# EAGLE design Felderblock mini (EAGLE 7.6.0)
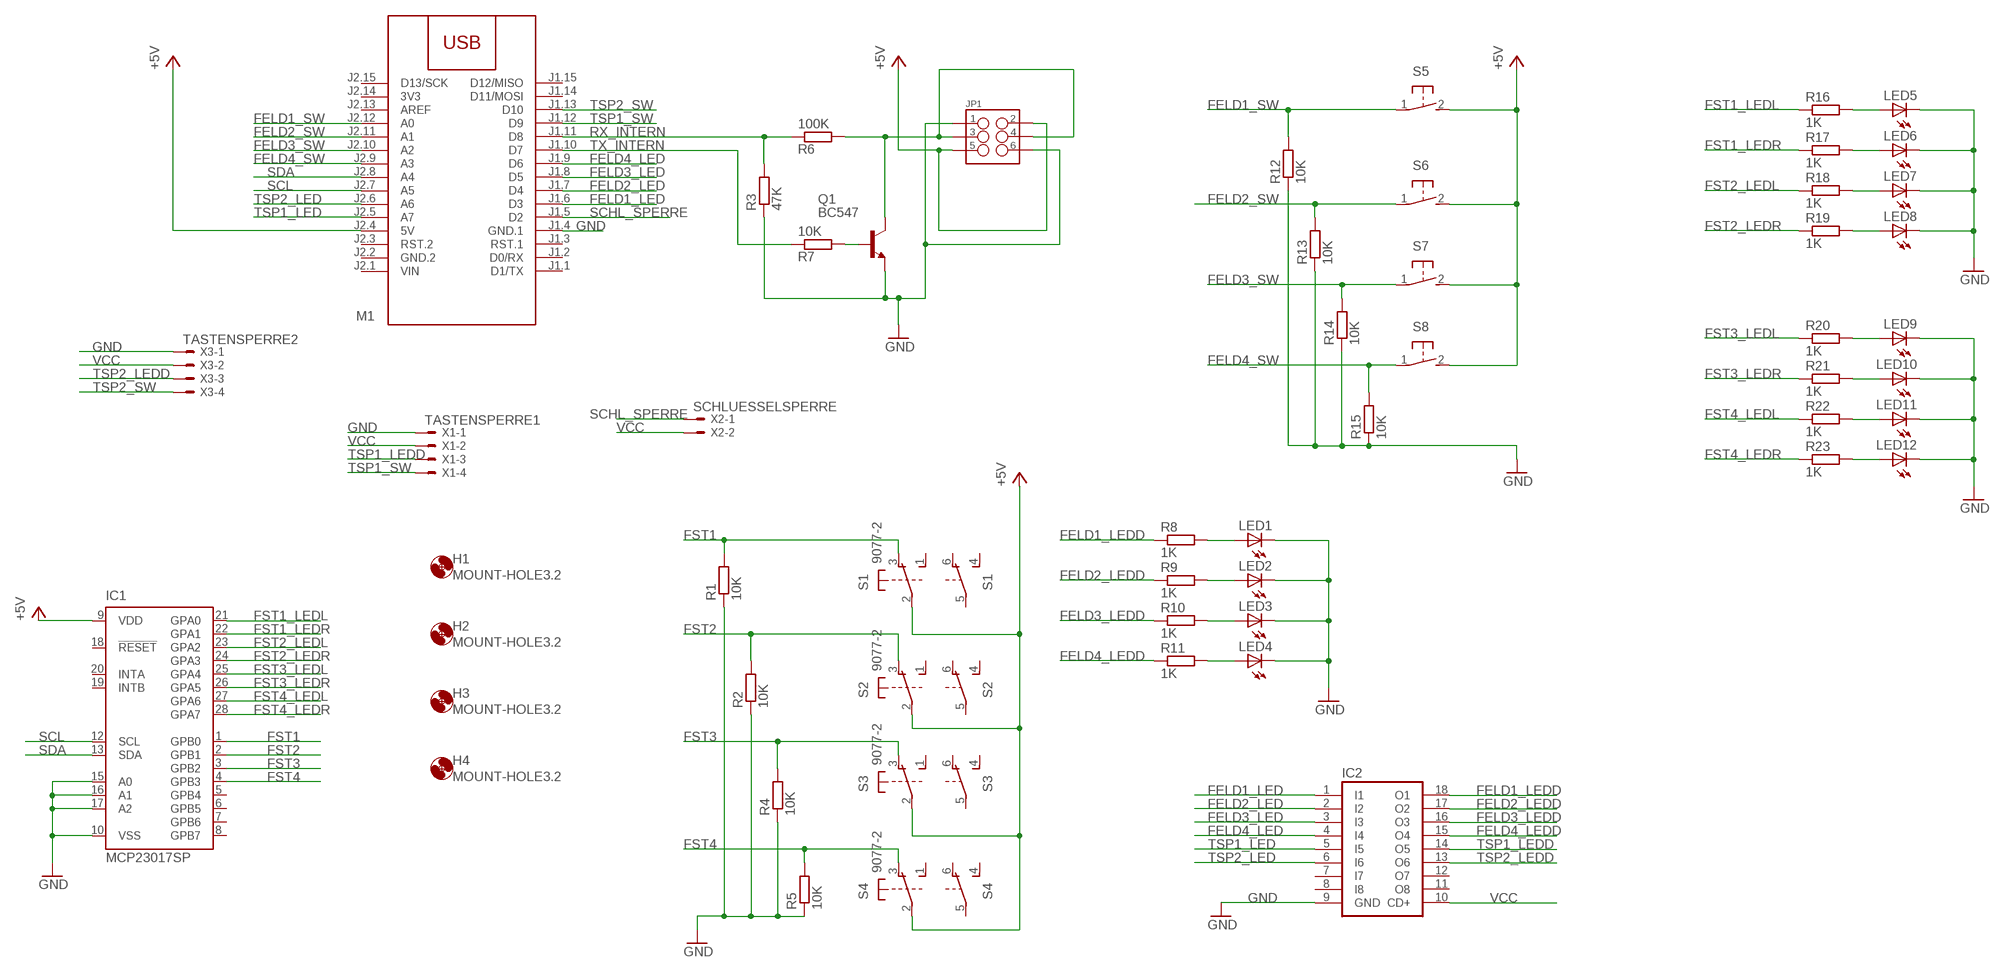
[diagram p0: schematic, sheet 1]

## Parts
H1  MOUNT-HOLE3.2  [3,2]
H2  MOUNT-HOLE3.2  [3,2]
H3  MOUNT-HOLE3.2  [3,2]
H4  MOUNT-HOLE3.2  [3,2]
IC1  MCP23017SP  [DIL28-3]
IC2  ULN2803A  [DIL18]
JP1  M03X2SHROUD  [2X3-SHROUDED]
LED1  LED10MM  [LED10MM]
LED2  LED10MM  [LED10MM]
LED3  LED10MM  [LED10MM]
LED4  LED10MM  [LED10MM]
LED5  LED5MM  [LED5MM]
LED6  LED5MM  [LED5MM]
LED7  LED5MM  [LED5MM]
LED8  LED5MM  [LED5MM]
LED9  LED5MM  [LED5MM]
LED10  LED5MM  [LED5MM]
LED11  LED5MM  [LED5MM]
LED12  LED5MM  [LED5MM]
M1  ARDUINO-NANO-3.0  [ARDUINO-NANO-3.0]
Q1  BC547  [TO92]
R1  10K  R-EU_0207/7  [0207/7]
R2  10K  R-EU_0207/7  [0207/7]
R3  47K  R-EU_R1206  [R1206]
R4  10K  R-EU_0207/7  [0207/7]
R5  10K  R-EU_0207/7  [0207/7]
R6  100K  R-EU_R1206  [R1206]
R7  10K  R-EU_R1206  [R1206]
R8  1K  R-EU_0207/7  [0207/7]
R9  1K  R-EU_0207/7  [0207/7]
R10  1K  R-EU_0207/7  [0207/7]
R11  1K  R-EU_0207/7  [0207/7]
R12  10K  R-EU_0207/7  [0207/7]
R13  10K  R-EU_0207/7  [0207/7]
R14  10K  R-EU_0207/7  [0207/7]
R15  10K  R-EU_0207/7  [0207/7]
R16  1K  R-EU_0207/7  [0207/7]
R17  1K  R-EU_0207/7  [0207/7]
R18  1K  R-EU_0207/7  [0207/7]
R19  1K  R-EU_0207/7  [0207/7]
R20  1K  R-EU_0207/7  [0207/7]
R21  1K  R-EU_0207/7  [0207/7]
R22  1K  R-EU_0207/7  [0207/7]
R23  1K  R-EU_0207/7  [0207/7]
S1  9077-2  [9077-2]
S2  9077-2  [9077-2]
S3  9077-2  [9077-2]
S4  9077-2  [9077-2]
S5  31-XX  [B3F-31XX]
S6  31-XX  [B3F-31XX]
S7  31-XX  [B3F-31XX]
S8  31-XX  [B3F-31XX]
X1  TASTENSPERRE1  22-23-2041  [22-23-2041]
X2  SCHLUESSELSPERRE  22-23-2021  [22-23-2021]
X3  TASTENSPERRE2  22-23-2041  [22-23-2041]

## Nets
FELD1_LED: IC2.1(I1) M1.J1.6(D3)
FELD1_LEDD: IC2.18(O1) R8.1
FELD1_SW: M1.J2.12(A0) R12.2 S5.1(P)
FELD2_LED: IC2.2(I2) M1.J1.7(D4)
FELD2_LEDD: IC2.17(O2) R9.1
FELD2_SW: M1.J2.11(A1) R13.2 S6.1(P)
FELD3_LED: IC2.3(I3) M1.J1.8(D5)
FELD3_LEDD: IC2.16(O3) R10.1
FELD3_SW: M1.J2.10(A2) R14.2 S7.1(P)
FELD4_LED: IC2.4(I4) M1.J1.9(D6)
FELD4_LEDD: IC2.15(O4) R11.1
FELD4_SW: M1.J2.9(A3) R15.2 S8.1(P)
FST1: IC1.1(GPB0) R1.2 S1.3(1:O)
FST1_LEDL: IC1.21(GPA0) R16.1
FST1_LEDR: IC1.22(GPA1) R17.1
FST2: IC1.2(GPB1) R2.2 S2.3(1:O)
FST2_LEDL: IC1.23(GPA2) R18.1
FST2_LEDR: IC1.24(GPA3) R19.1
FST3: IC1.3(GPB2) R4.2 S3.3(1:O)
FST3_LEDL: IC1.25(GPA4) R20.1
FST3_LEDR: IC1.26(GPA5) R21.1
FST4: IC1.4(GPB3) R5.2 S4.3(1:O)
FST4_LEDL: IC1.27(GPA6) R22.1
FST4_LEDR: IC1.28(GPA7) R23.1
GND: IC1.10(VSS) IC1.15(A0) IC1.16(A1) IC1.17(A2) IC2.9(GND) JP1.1 JP1.6 LED1.C LED2.C LED3.C LED4.C LED5.K(C) LED6.K(C) LED7.K(C) LED8.K(C) LED9.K(C) LED10.K(C) LED11.K(C) LED12.K(C) M1.J1.4(GND.1) Q1.1(E) R1.1 R2.1 R3.1 R4.1 R5.1 R12.1 R13.1 R14.1 R15.1 X1.1 X3.1
LN: JP1.3 JP1.4 Q1.3(C) R6.2
N$1: LED1.A R8.2
N$2: LED2.A R9.2
N$3: LED3.A R10.2
N$4: LED4.A R11.2
N$5: Q1.2(B) R7.2
N$6: LED5.A R16.2
N$7: LED6.A R17.2
N$8: LED7.A R18.2
N$9: LED8.A R19.2
N$10: LED9.A R20.2
N$11: LED10.A R21.2
N$12: LED11.A R22.2
N$13: LED12.A R23.2
RX_INTERN: M1.J1.11(D8) R3.2 R6.1
SCHL_SPERRE: M1.J1.5(D2) X2.1
SCL: IC1.12(SCL) M1.J2.7(A5)
SDA: IC1.13(SDA) M1.J2.8(A4)
TSP1_LED: IC2.5(I5) M1.J2.5(A7)
TSP1_LEDD: IC2.14(O5) X1.3
TSP1_SW: M1.J1.12(D9) X1.4
TSP2_LED: IC2.6(I6) M1.J2.6(A6)
TSP2_LEDD: IC2.13(O6) X3.3
TSP2_SW: M1.J1.13(D10) X3.4
TX_INTERN: M1.J1.10(D7) R7.1
VCC: IC1.9(VDD) IC2.10(CD+) JP1.2 JP1.5 M1.J2.4(5V) S1.2(1:P) S2.2(1:P) S3.2(1:P) S4.2(1:P) S5.2(S) S6.2(S) S7.2(S) S8.2(S) X1.2 X2.2 X3.2 ; supply symbol labelled +5V
Unconnected: IC1.5(GPB4) IC1.6(GPB5) IC1.7(GPB6) IC1.8(GPB7) IC1.18(!RESET) IC1.19(INTB) IC1.20(INTA) IC2.7(I7) IC2.8(I8) IC2.11(O8) IC2.12(O7) M1.J1.1(D1/TX) M1.J1.2(D0/RX) M1.J1.3(RST.1) M1.J1.14(D11/MOSI) M1.J1.15(D12/MISO) M1.J2.3(RST.2) M1.J2.13(AREF) M1.J2.15(D13/SCK) S1.1(1:S) S1.4(2:S) S1.5(2:P) S1.6(2:O) S2.1(1:S) S2.4(2:S) S2.5(2:P) S2.6(2:O) S3.1(1:S) S3.4(2:S) S3.5(2:P) S3.6(2:O) S4.1(1:S) S4.4(2:S) S4.5(2:P) S4.6(2:O)

## Power pins joined to a net without a drawn wire
3V3: M1.J2.14(3V3)
GND.2: M1.J2.2(GND.2)
VIN: M1.J2.1(VIN)

## Library data of the parts
H1-H4 = holes:MOUNT-HOLE: MOUNTING HOLE with drill center marker
IC1 = microchip:MCP23017: http://ww1.microchip.com/downloads/en/DeviceDoc/21952a.pdf Source: http://ww1.microchip.com/downloads/en/DeviceDoc/21952a.pdf; MF: MICROCHIP; MPN: MCP23017-E/SP; OC_FARNELL: 1332088; OC_NEWARK: 31K2959
IC2 = uln-udn:ULN2803A: DRIVER ARRAY
JP1 = SparkFun-Connectors:M03X2: 2x3 .1" header. Shrouded, with keying- CONN-10681 SMT- CONN-11415 Pogo pins- HW-11044; PROD_ID: CONN-10681
LED1-LED12 = SparkFun-LED:LED: LEDs Standard schematic elements and footprints for 5mm, 3mm, 1206, and 0603 sized LEDs. 5mm - Spark Fun Electronics SKU : COM-00529 (and others)
M1 = diy-modules:ARDUINO-NANO-3.0: Arduino Nano 3.0
Q1 = transistor-npn:BC547*: NPN Transistor
R1 R2 R4 R5 R8-R23 = resistor:R-EU_: RESISTOR, European symbol
R3 R6 R7 = StationInterfaceGateway:R-EU_: RESISTOR, European symbol
S1-S4 = switch-misc:9077-2: MARQUARDT SWITCH 9077.0200 Distributor: Buerklin <https://www.buerklin.com/default.asp?event=ShowArtikel%2812G2822%29&l=d&jump=ArtNr_12G2822>
S5-S8 = switch-omron:31-XX: OMRON SWITCH; MPN: B3F-3100; OC_FARNELL: 959704; OC_NEWARK: 36M3582
X1 X3 = con-molex:22-23-2041: .100" (2.54mm) Center Header - 4 Pin; MF: MOLEX; MPN: 22-23-2041; OC_FARNELL: 1462920; OC_NEWARK: 38C0355
X2 = con-molex:22-23-2021: .100" (2.54mm) Center Header - 2 Pin; MF: MOLEX; MPN: 22-23-2021; OC_FARNELL: 1462926; OC_NEWARK: 25C3832

## Board
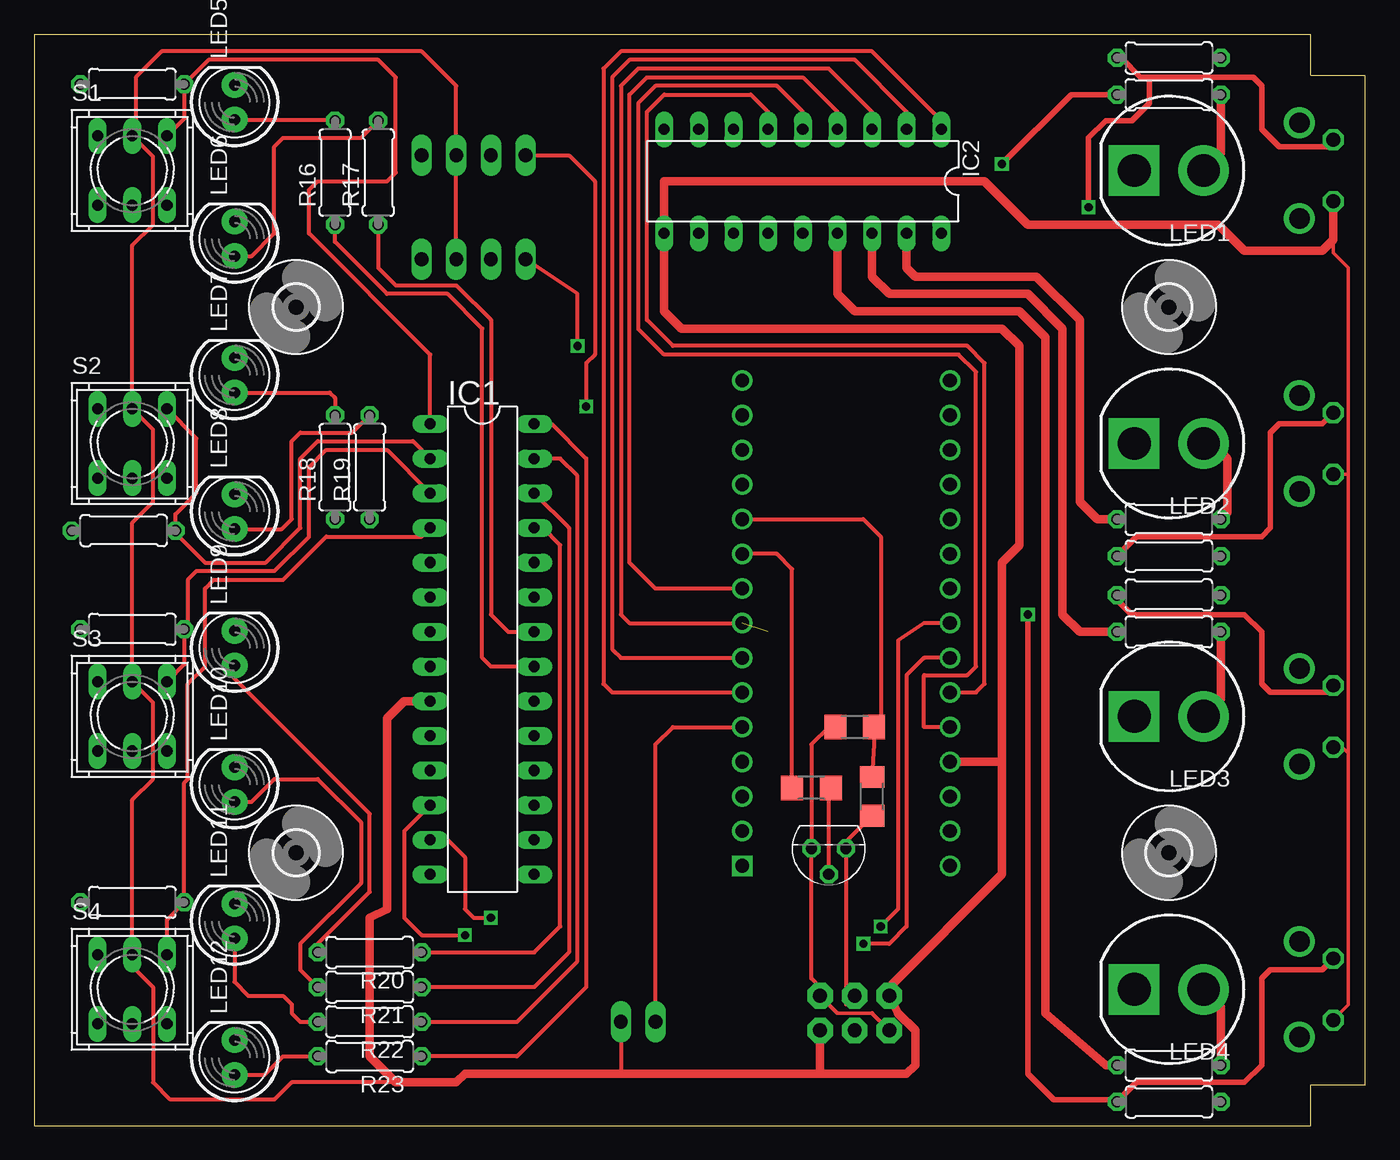
[diagram p1: board, top side]
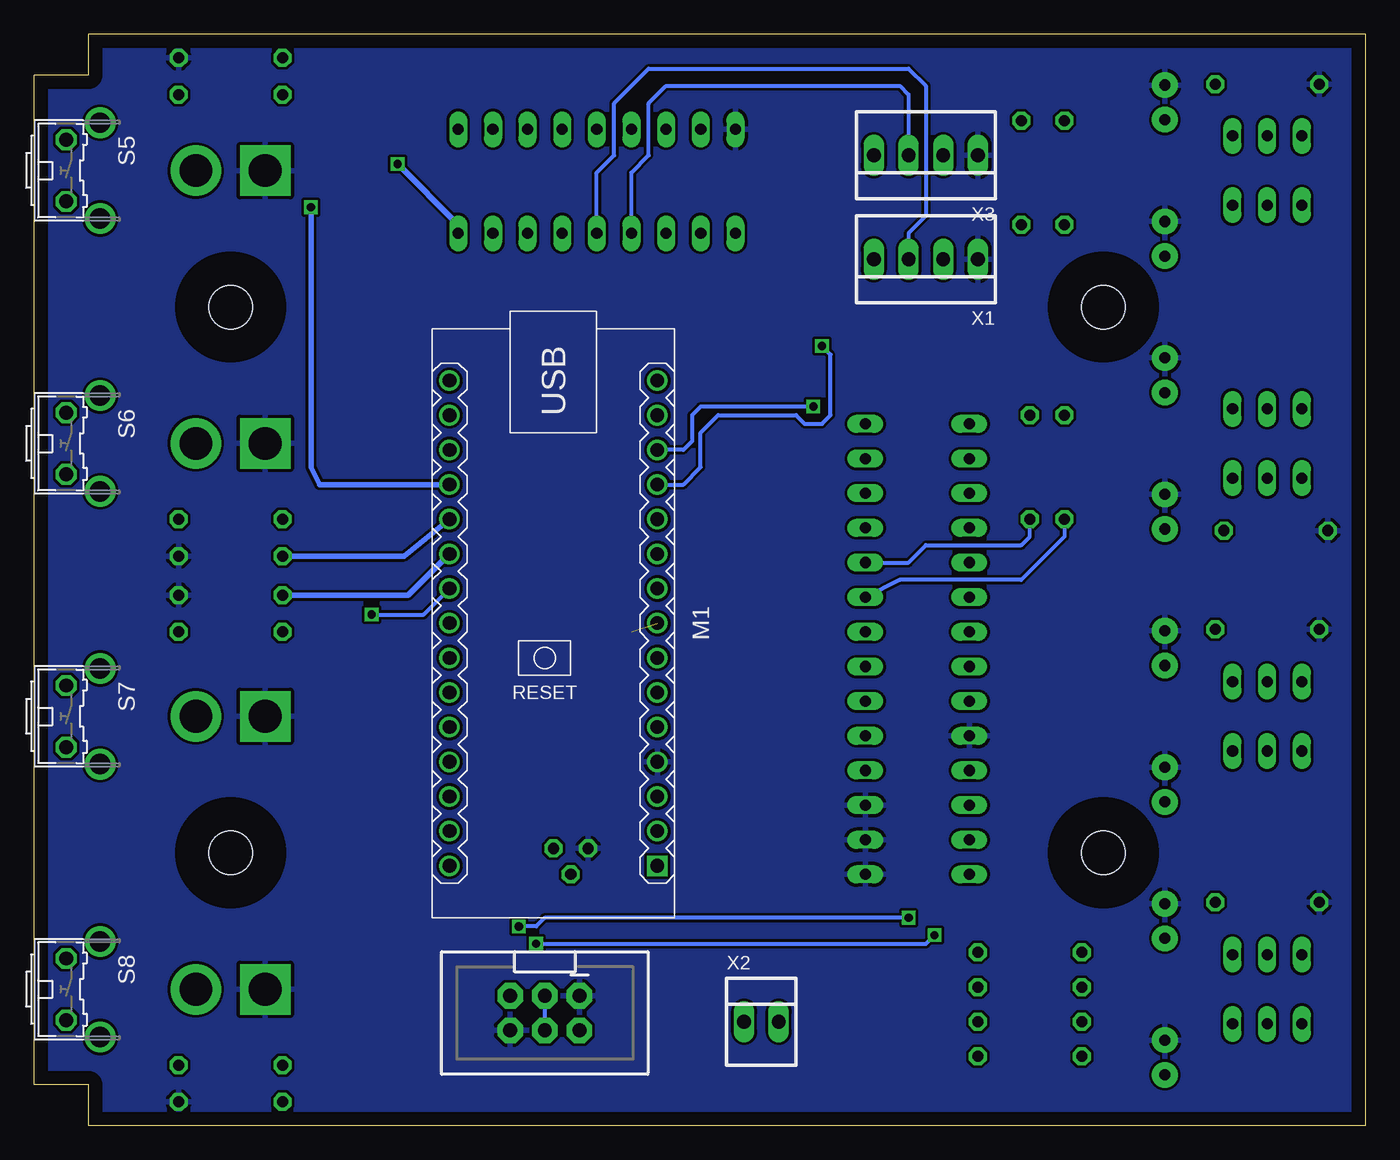
[diagram p2: board, bottom side, seen from below]

Size 97.6 x 80 mm. Coordinates in mm from the lower left corner, seen from the top.
Outline: 0,0 93.6,0 93.6,3 97.6,3 97.6,77 93.6,77 93.6,80 0,80 0,0
Copper layers (1*16): Top 0.035mm / dielectric 1.5mm / Bottom 0.035mm
Design rules "default": minimum track width 10mil, minimum drill 24mil, track to track 8mil, track to pad 8mil, pad to pad 8mil, via to via 8mil, smd to smd 8mil, copper to edge 40mil, drill to drill 8mil, minimum pad ring 10mil, minimum via ring 8mil, stop-mask expansion 4mil, vias tented up to drill 0mil, thermal gap 10mil

### Footprints (pad centres in the part's own frame; a part is rotated, then mirrored left to right if it is on the bottom)
3,2 = hole 3.2: 0,0
DIL28-3 = drill 0.813 long: 1 -16.51,-3.81; 2 -13.97,-3.81; 3 -11.43,-3.81; 4 -8.89,-3.81; 5 -6.35,-3.81; 6 -3.81,-3.81; 7 -1.27,-3.81; 8 1.27,-3.81; 9 3.81,-3.81; 10 6.35,-3.81; 11 8.89,-3.81; 12 11.43,-3.81; 13 13.97,-3.81; 14 16.51,-3.81; 15 16.51,3.81; 16 13.97,3.81; 17 11.43,3.81; 18 8.89,3.81; 19 6.35,3.81; 20 3.81,3.81; 21 1.27,3.81; 22 -1.27,3.81; 23 -3.81,3.81; 24 -6.35,3.81; 25 -8.89,3.81; 26 -11.43,3.81; 27 -13.97,3.81; 28 -16.51,3.81
DIL18 = drill 0.813 long: 1 -10.16,-3.81; 2 -7.62,-3.81; 3 -5.08,-3.81; 4 -2.54,-3.81; 5 0,-3.81; 6 2.54,-3.81; 7 5.08,-3.81; 8 7.62,-3.81; 9 10.16,-3.81; 10 10.16,3.81; 11 7.62,3.81; 12 5.08,3.81; 13 2.54,3.81; 14 0,3.81; 15 -2.54,3.81; 16 -5.08,3.81; 17 -7.62,3.81; 18 -10.16,3.81
2X3-SHROUDED = drill 1.016 pad 1.88 octagon: 1 -1.27,2.54; 2 1.27,2.54; 3 -1.27,0; 4 1.27,0; 5 -1.27,-2.54; 6 1.27,-2.54
LED10MM = drill 2.4 pad 3.7: A 2.54,0 | drill 2.4 pad 3.7 square: C -2.54,0
LED5MM = drill 0.813 pad 1.88: A -1.27,0; K 1.27,0
ARDUINO-NANO-3.0 = drill 1 square: J1.1 17.78,7.62 | drill 1: J1.2 15.24,7.62; J1.3 12.7,7.62; J1.4 10.16,7.62; J1.5 7.62,7.62; J1.6 5.08,7.62; J1.7 2.54,7.62; J1.8 0,7.62; J1.9 -2.54,7.62; J1.10 -5.08,7.62; J1.11 -7.62,7.62; J1.12 -10.16,7.62; J1.13 -12.7,7.62; J1.14 -15.24,7.62; J1.15 -17.78,7.62; J2.1 17.78,-7.62; J2.2 15.24,-7.62; J2.3 12.7,-7.62; J2.4 10.16,-7.62; J2.5 7.62,-7.62; J2.6 5.08,-7.62; J2.7 2.54,-7.62; J2.8 0,-7.62; J2.9 -2.54,-7.62; J2.10 -5.08,-7.62; J2.11 -7.62,-7.62; J2.12 -10.16,-7.62; J2.13 -12.7,-7.62; J2.14 -15.24,-7.62; J2.15 -17.78,-7.62
TO92 = drill 0.813 octagon: 1 1.27,0; 2 0,1.905; 3 -1.27,0
0207/7 = drill 0.813 octagon: 1 -3.81,0; 2 3.81,0
R1206 = smd 1.6 x 1.803: 1 -1.422,0; 2 1.422,0
9077-2 = drill 0.813 long: 1 -2.54,2.54; 2 0,2.54; 3 2.54,2.54; 4 -2.54,-2.54; 5 0,-2.54; 6 2.54,-2.54
B3F-31XX = drill 1.016 octagon: 1 -2.261,-1.245; 2 2.261,-1.245 | drill 1.499 pad 2.159: 3 -3.505,1.245; 4 3.505,1.245
22-23-2041 = drill 1 long: 1 -3.81,0; 2 -1.27,0; 3 1.27,0; 4 3.81,0
22-23-2021 = drill 1 long: 1 -1.27,0; 2 1.27,0

### Placement (x,y rotation side)
H1  83.2,20 0 top
H2  19.2,20 0 top
H3  19.2,60 0 top
H4  83.2,60 0 top
IC1  32.86,34.92 270 top
IC2  56.35,69.22 180 top
JP1  60.16,8.26 270 bottom
LED1  83.2,70 0 top
LED2  83.2,50 0 top
LED3  83.2,30 0 top
LED4  83.2,10 0 top
LED5  14.7,75 90 top
LED6  14.7,65 90 top
LED7  14.7,55 90 top
LED8  14.7,45 90 top
LED9  14.7,35 90 top
LED10  14.7,25 90 top
LED11  14.7,15 90 top
LED12  14.7,5 90 top
M1  59.53,36.83 270 bottom
Q1  58.26,20.32 180 top
R1  7.2,76.33 0 top
R2  6.57,43.62 0 top
R3  60.16,29.21 0 top
R4  7.2,36.38 0 top
R5  7.2,16.38 0 top
R6  61.43,24.13 270 top
R7  56.98,24.77 0 top
R8  83.2,75.56 0 top
R9  83.2,44.45 0 top
R10  83.2,36.2 0 top
R11  83.2,4.45 0 top
R12  83.2,78.25 180 top
R13  83.2,41.74 180 top
R14  83.2,38.89 180 top
R15  83.2,1.75 180 top
R16  22.06,69.85 90 top
R17  25.23,69.85 90 top
R18  22.06,48.26 90 top
R19  24.6,48.26 90 top
R20  24.6,12.7 180 top
R21  24.6,10.16 180 top
R22  24.6,7.62 180 top
R23  24.6,5.08 180 top
S1  7.2,70 0 top
S2  7.2,50 0 top
S3  7.2,30 0 top
S4  7.2,10 0 top
S5  94,70 270 bottom
S6  94,50 270 bottom
S7  94,30 270 bottom
S8  94,10 270 bottom
X1  32.22,63.5 180 bottom
X2  44.29,7.62 0 bottom
X3  32.22,71.12 180 bottom

### Tracks (layer width: path | path; a pad name or v marks a point on that pad's centre or on a via)
FELD1_LED
  Top 0.305: IC2.1 66.51,73.66 61.43,78.74 43.02,78.74 41.75,77.47 41.75,32.38 42.38,31.75 M1.J1.6
FELD1_LEDD  (via drill 0.6)
  Top 0.406: R8.1 76.03,75.56 v70.95,70.48
  Bottom 0.406: v70.95,70.48 66.51,66.04 IC2.18
FELD1_SW  (via drill 0.6)
  Top 0.406: R12.2 79.7,78.25 81.12,76.83 81.75,76.83 | 81.75,76.83 89.37,76.83 90.01,76.2 90.01,73.03 91.28,71.75 94.74,71.75 S5.1 | v77.31,67.31 77.31,72.39 78.58,73.66 80.48,73.66 81.75,74.93 81.75,76.83
  Bottom 0.406: M1.J2.12 76.67,46.99 77.31,48.26 v77.31,67.31
FELD2_LED
  Top 0.305: IC2.2 63.97,74.3 60.16,78.11 43.65,78.11 42.38,76.83 42.38,34.92 43.02,34.29 M1.J1.7
FELD2_LEDD
  Top 0.61: IC2.17 63.97,62.87 64.61,62.23 73.5,62.23 76.67,59.05 76.67,45.72 77.94,44.45 R9.1
FELD2_SW
  Top 0.406: S6.1 95.25,52.23 94.45,51.44 91.28,51.44 90.64,50.8 90.64,43.81 90.01,43.18 80.83,43.18 R13.2
  Bottom 0.406: R13.2 70.48,41.74 M1.J2.11
FELD3_LED  (1 unrouted)
  Top 0.305: IC2.3 61.43,74.3 58.26,77.47 44.29,77.47 43.02,76.2 43.02,37.47 43.65,36.83 M1.J1.8
FELD3_LEDD
  Top 0.61: R10.1 76.67,36.2 75.4,37.47 75.4,58.42 72.86,60.96 62.7,60.96 61.43,62.23 IC2.16
FELD3_SW
  Top 0.406: R14.2 79.39,38.55 80.48,37.47 88.73,37.47 90.01,36.2 90.01,32.38 90.64,31.75 94.73,31.75 S7.1
  Bottom 0.406: R14.2 70.17,38.89 M1.J2.10
FELD4_LED
  Top 0.305: M1.J1.9 45.55,39.37 43.65,41.27 43.65,75.56 44.92,76.83 56.35,76.83 58.89,74.3 IC2.4
FELD4_LEDD
  Top 0.61: R11.1 78.58,4.45 74.13,8.26 74.13,57.78 72.23,59.69 60.16,59.69 58.89,60.96 IC2.15
FELD4_SW  (via drill 0.6)
  Top 0.406: S8.1 95.25,12.22 94.45,11.43 90.64,11.43 90.01,10.79 90.01,4.45 88.73,3.17 80.82,3.17 R15.2 79.23,1.91 74.77,1.91 72.86,3.81 v72.86,37.47
  Bottom 0.305: v72.86,37.47 69.05,37.47 M1.J2.9
FST1
  Top 0.305: IC1.1 29.04,56.52 20.15,65.41 20.15,68.58 20.79,69.22 25.87,69.22 26.5,69.85 26.5,76.83 25.23,78.11 12.79,78.11 R1.2 11.01,73.81 S1.3
FST1_LEDL
  Top 0.305: IC1.21 33.49,33.66 32.86,34.29 32.86,58.42 30.31,60.96 25.87,60.96 22.06,64.77 R16.1
FST1_LEDR
  Top 0.305: R17.1 25.23,62.87 26.5,61.59 30.95,61.59 33.49,59.05 33.49,37.47 34.76,36.2 IC1.22
FST2
  Top 0.305: IC1.2 27.77,50.16 20.79,50.16 19.52,48.9 19.52,43.81 16.98,41.27 12.54,41.27 10.38,43.44 R2.2 10.38,44.83 11.9,46.35 11.9,50.38 S2.3
FST2_LEDL
  Bottom 0.305: R18.1 22.06,43.18 25.23,40.01 34.12,40.01 IC1.23
FST2_LEDR
  Bottom 0.305: IC1.24 33.49,41.27 32.22,42.55 25.23,42.55 24.6,43.18 R19.1
FST3
  Top 0.305: S3.3 11.01,33.81 R4.2 11.26,36.63 11.26,40.01 11.9,40.64 17.61,40.64 20.15,43.18 20.15,48.26 21.43,49.53 25.87,49.53 IC1.3
FST3_LEDL
  Top 0.305: IC1.25 37.3,43.81 38.57,42.55 38.57,14.61 36.67,12.7 R20.1
FST3_LEDR
  Top 0.305: IC1.26 39.21,43.81 39.21,12.7 36.67,10.16 R21.1
FST4
  Top 0.305: S4.3 9.74,15.11 R5.2 11.01,25.14 11.26,25.4 11.26,32.38 12.54,33.66 12.54,39.37 13.17,40.01 18.25,40.01 21.43,43.18 28.41,43.18 IC1.4
FST4_LEDL
  Top 0.305: R22.1 35.4,7.62 39.84,12.06 39.84,47.62 38.57,48.9 IC1.27
FST4_LEDR
  Top 0.305: IC1.28 37.94,51.44 40.48,48.9 40.48,10.16 35.4,5.08 R23.1
GND
  Top 0.254: 58.89,8.26 61.43,8.26
  Top 0.305: 58.89,8.26 JP1.1 57.62,10.16 56.98,10.79 Q1.1 56.98,27.94 58.26,29.21 R3.1 | 61.43,8.26 JP1.6
  pour Bottom: 0.47,80.01 93.18,80.01 93.18,76.83 96.99,76.83 97.62,76.83 97.62,3.17 93.18,3.17 93.18,2.54 93.18,0 0.47,0
LN
  Top 0.305: R6.2 59.53,20.8 Q1.3 59.53,8.89 JP1.3
  Bottom 0.305: JP1.3 JP1.4
N$1
  Top 0.61: R8.2 87.01,71.27 LED1.A
N$2
  Top 0.61: LED2.A 86.36,50 87.47,48.9 87.47,44.91 R9.2
N$3
  Top 0.61: R10.2 87.01,31.27 LED3.A
N$4
  Top 0.61: R11.2 87.01,8.73 LED4.A
N$5
  Top 0.305: Q1.2 58.26,24.61 R7.2
N$6
  Top 0.305: LED5.A 21.99,73.73 R16.2
N$7
  Top 0.305: LED6.A 15.94,63.73 17.61,65.41 17.61,71.75 18.25,72.39 23.96,72.39 R17.2
N$8
  Top 0.305: LED7.A 21.67,53.73 22.06,53.34 R18.2
N$9
  Top 0.305: LED8.A 18.16,43.73 18.88,44.45 18.88,50.16 19.52,50.8 23.33,50.8 R19.2
N$10
  Top 0.305: R20.2 20.79,13.34 24.6,17.14 24.6,22.86 14.44,33.02 14.44,33.47 LED9.A
N$11
  Top 0.305: LED10.A 15.95,23.73 17.61,25.4 20.79,25.4 23.96,22.23 23.96,17.78 19.52,13.34 19.52,11.43 R21.2
N$12
  Top 0.305: LED11.A 14.7,10.54 15.71,9.53 18.25,9.53 18.88,8.89 18.88,8.26 19.52,7.62 R22.2
N$13
  Top 0.305: LED12.A 16.9,3.73 18.25,5.08 R23.2
RX_INTERN
  Top 0.305: M1.J1.11 60.8,44.45 62.07,43.18 62.07,29.69 R3.2 61.58,27.94 R6.1
SCHL_SPERRE
  Top 0.305: X2.1 45.55,27.94 46.83,29.21 M1.J1.5
SCL  (via drill 0.6)
  Top 0.305: M1.J2.7 65.24,34.29 63.97,33.02 63.97,14.61 62.7,13.34 v60.8,13.34 | IC1.12 27.14,21.59 27.14,15.24 28.41,13.97 v31.58,13.97
  Bottom 0.305: v60.8,13.34 32.22,13.34 v31.58,13.97
SDA  (via drill 0.6)
  Top 0.305: M1.J2.8 65.24,36.83 63.34,35.56 63.34,15.88 v62.07,14.61 | IC1.13 30.31,20.95 31.58,19.68 31.58,15.88 32.22,15.24 v33.49,15.24
  Bottom 0.305: v33.49,15.24 60.16,15.24 60.8,14.61 v62.07,14.61
TSP1_LED
  Top 0.305: IC2.5 56.35,74.3 54.45,76.2 45.55,76.2 44.29,74.93 44.29,58.42 46.19,56.52 67.78,56.52 69.05,55.24 69.05,33.66 68.42,33.02 65.24,33.02 65.24,29.21 M1.J2.5
TSP1_LEDD
  Bottom 0.305: IC2.14 56.35,69.85 55.08,71.12 55.08,74.93 52.54,77.47 33.49,77.47 32.22,76.2 32.22,66.67 33.49,65.41 X1.3
TSP1_SW  (via drill 0.6)
  Top 0.305: v39.84,57.15 39.84,60.96 X1.4
  Bottom 0.305: M1.J1.12 50,46.99 48.73,48.26 48.73,50.8 47.46,52.07 41.75,52.07 41.11,51.44 39.84,51.44 39.21,52.07 39.21,56.52 v39.84,57.15
TSP2_LED
  Top 0.305: IC2.6 53.81,74.3 52.54,75.56 46.19,75.56 44.92,74.3 44.92,59.05 46.83,57.15 68.42,57.15 69.69,55.88 69.69,32.38 69.05,31.75 M1.J2.6
TSP2_LEDD
  Bottom 0.305: IC2.13 53.81,69.85 52.54,71.12 52.54,74.93 51.27,76.2 34.12,76.2 33.49,75.56 X3.3
TSP2_SW  (via drill 0.6)
  Top 0.305: X3.4 39.21,71.12 41.11,69.22 41.11,56.52 40.48,55.88 v40.48,52.7
  Bottom 0.305: v40.48,52.7 48.73,52.7 49.37,52.07 49.37,50.16 50,49.53 M1.J1.13
TX_INTERN
  Top 0.305: R7.1 55.56,40.79 54.45,41.91 M1.J1.10
VCC
  Top 0.254: 95.25,64.93 95.25,63.98 96.36,62.87 96.36,47.62 | 96.36,47.62 96.36,27.3 | 96.36,27.3 96.36,8.85 S8.2 | S7.2 95.92,27.74 96.36,27.3 | S6.2 96.24,47.74 96.36,47.62
  Top 0.305: 26.5,3.17 18.88,3.17 17.61,1.91 9.99,1.91 8.72,3.17 8.72,10.16 7.2,11.69 S4.2 7.2,23.88 8.72,25.4 8.72,31.02 S3.2 7.2,44.2 8.72,45.72 8.72,51.02 S2.2 7.2,64.52 8.72,66.04 8.72,71.02 S1.2 7.46,72.8 7.46,76.83 9.36,78.74 28.41,78.74 30.95,76.2 X3.2 X1.2 | X2.2 43.02,3.81
  Top 0.406: S8.2 95.25,7.78
  Top 0.61: S5.2 95.25,64.93 94.45,64.14 88.73,64.14 86.83,66.04 72.86,66.04 69.69,69.22 46.19,69.22 IC2.10 46.19,59.69 47.46,58.42 70.95,58.42 72.23,57.15 72.23,42.55 70.95,41.27 70.95,26.67 | 57.62,3.81 63.97,3.81 64.61,4.45 64.61,6.99 63.34,8.26 JP1.5 62.7,10.16 70.95,18.41 70.95,26.67 | 57.62,3.81 43.02,3.81 31.58,3.81 30.95,3.17 26.5,3.17 24.6,5.08 24.6,15.24 25.87,15.88 25.87,29.84 27.14,31.11 IC1.9 | 70.95,26.67 M1.J2.4 | JP1.2 57.62,3.81